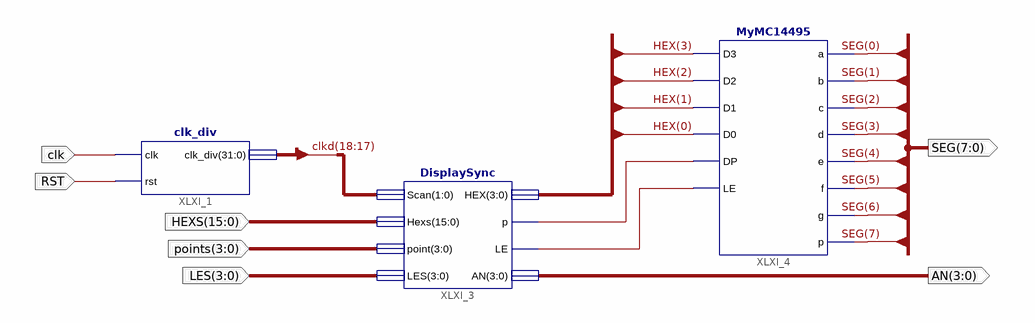
[diagram p0: schematic sheet 1]
// Xilinx ISE schematic disp_num.sch (kintex7) as structural Verilog: 3 symbols, 7 ports
module disp_num (
  input  RST,
  input  clk,
  input  [15:0] HEXS,
  input  [3:0] points,
  input  [3:0] LES,
  output [3:0] AN,
  output [7:0] SEG
);

  wire XLXN_41, XLXN_42;
  wire [3:0] HEX;
  wire [31:0] clkd;

  clk_div XLXI_1 (.clk(clk), .rst(RST), .clk_div(clkd));
  DisplaySync XLXI_3 (
    .AN(AN), .HEX(HEX), .Hexs(HEXS), .LE(XLXN_42), .LES(LES), .p(XLXN_41), .point(points), .Scan(clkd[18:17]));
  MyMC14495 XLXI_4 (
    .a(SEG[0]), .b(SEG[1]), .c(SEG[2]), .d(SEG[3]), .D0(HEX[0]), .D1(HEX[1]), .D2(HEX[2]), .D3(HEX[3]),
    .DP(XLXN_41), .e(SEG[4]), .f(SEG[5]), .g(SEG[6]), .LE(XLXN_42), .p(SEG[7]));
endmodule
